# Altium schematic sheet CELL_BALANCE.SchDoc: BMS - AFE
size A4; DrawnBy: Jarod Krane; SheetNumber: 3; SheetTotal: 8
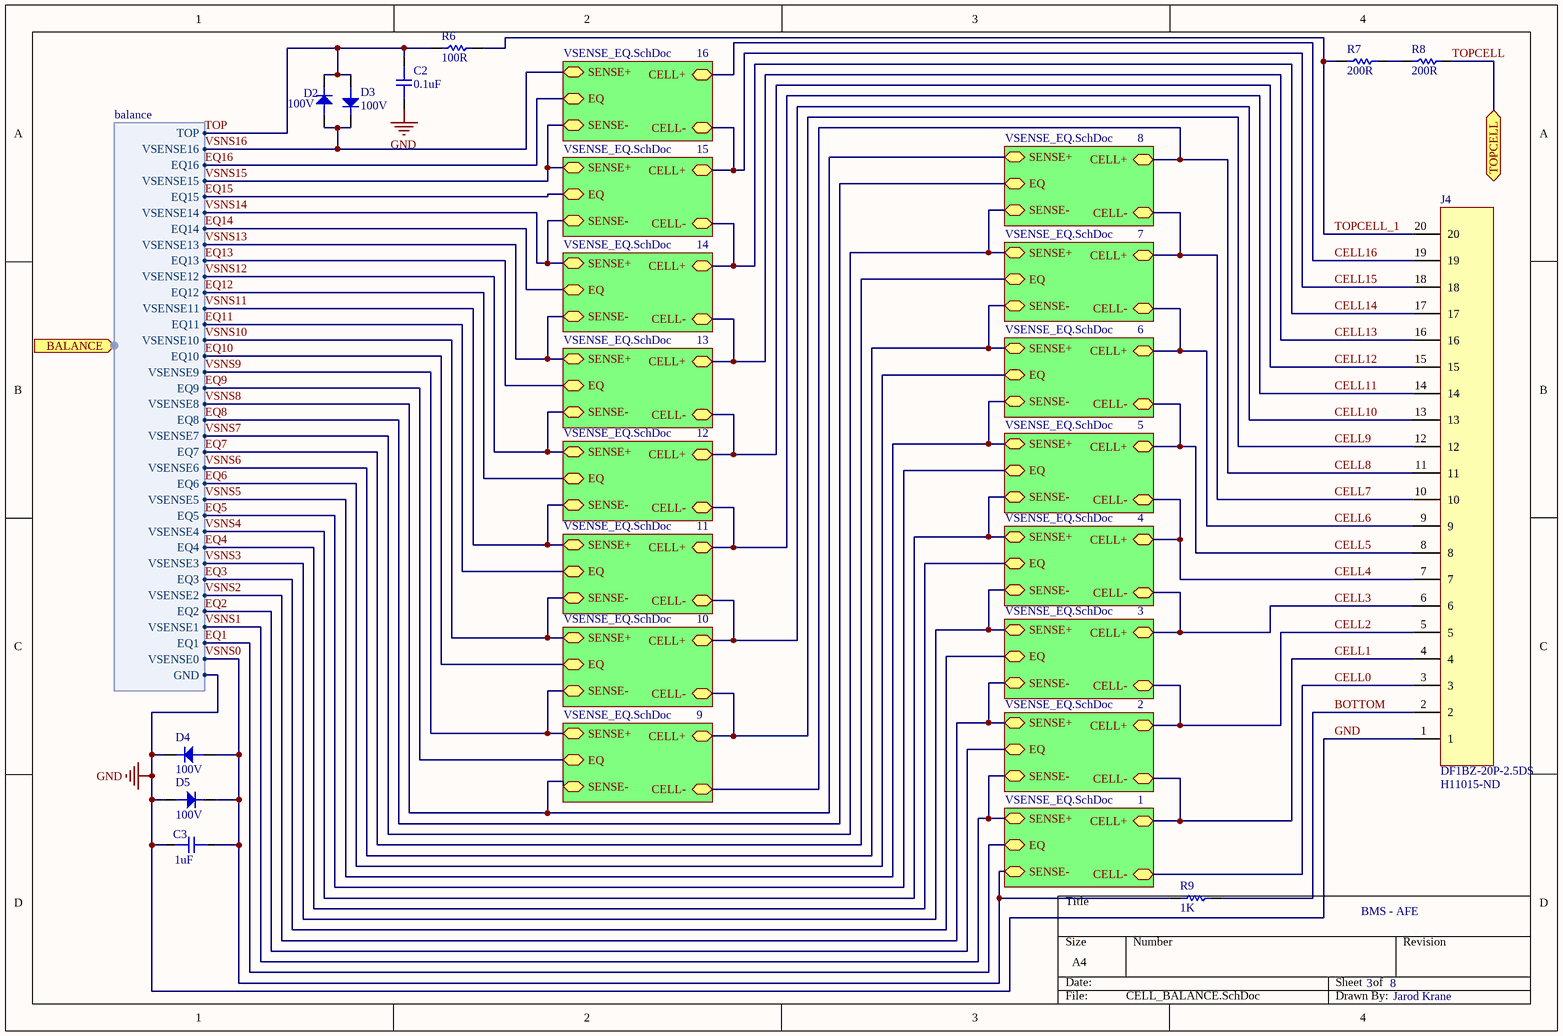
[diagram p0: CELL_BALANCE.SchDoc]

## Parts
C2  0.1uF  [1210 cap]
C3  1uF  [0603 CAP - duplicate]
D2  100V  [DIODE BtoB]
D3  100V  [DIODE BtoB]
D4  100V  [DIODE BtoB]
D5  100V  [DIODE BtoB]
J4  DF1BZ-20P-2.5DS  Supplier Part Number 1: H11015-ND  [PCBComponent_1]
R6  100R  [1206 RES]
R7  200R  [2512 RES]
R8  200R  [2512 RES]
R9  1K  [0603 RES]

## Sub-sheets
1 = VSENSE_EQ.SchDoc: SENSE+, CELL+, SENSE-, CELL-, EQ
2 = VSENSE_EQ.SchDoc: SENSE+, CELL+, SENSE-, CELL-, EQ
3 = VSENSE_EQ.SchDoc: SENSE+, CELL+, SENSE-, CELL-, EQ
4 = VSENSE_EQ.SchDoc: SENSE+, CELL+, SENSE-, CELL-, EQ
5 = VSENSE_EQ.SchDoc: SENSE+, CELL+, SENSE-, CELL-, EQ
6 = VSENSE_EQ.SchDoc: SENSE+, CELL+, SENSE-, CELL-, EQ
7 = VSENSE_EQ.SchDoc: SENSE+, CELL+, SENSE-, CELL-, EQ
8 = VSENSE_EQ.SchDoc: SENSE+, CELL+, SENSE-, CELL-, EQ
9 = VSENSE_EQ.SchDoc: SENSE+, CELL+, SENSE-, CELL-, EQ
10 = VSENSE_EQ.SchDoc: SENSE+, CELL+, SENSE-, CELL-, EQ
11 = VSENSE_EQ.SchDoc: SENSE+, CELL+, SENSE-, CELL-, EQ
12 = VSENSE_EQ.SchDoc: SENSE+, CELL+, SENSE-, CELL-, EQ
13 = VSENSE_EQ.SchDoc: SENSE+, CELL+, SENSE-, CELL-, EQ
14 = VSENSE_EQ.SchDoc: SENSE+, CELL+, SENSE-, CELL-, EQ
15 = VSENSE_EQ.SchDoc: SENSE+, CELL+, SENSE-, CELL-, EQ
16 = VSENSE_EQ.SchDoc: SENSE+, CELL+, SENSE-, CELL-, EQ

## Ports
BALANCE (harness balance), TOPCELL

## Harnesses
balance: GND, VSENSE0, EQ1, VSENSE1, EQ2, VSENSE2, EQ3, VSENSE3, EQ4, VSENSE4, EQ5, VSENSE5, EQ6, VSENSE6, EQ7, VSENSE7, EQ8, VSENSE8, EQ9, VSENSE9, EQ10, VSENSE10, EQ11, VSENSE11, EQ12, VSENSE12, EQ13, VSENSE13, EQ14, VSENSE14, EQ15, VSENSE15, EQ16, VSENSE16, TOP

## Nets
GND: C2.1 C3.1 D4.2 D5.1 J4.1 ; port BALANCE.GND
BOTTOM: J4.2 R9.2
CELL0: J4.3 ; sheet 1/CELL-
CELL1: J4.4 ; sheet 2/CELL-, sheet 1/CELL+
CELL2: J4.5 ; sheet 3/CELL-, sheet 2/CELL+
CELL3: J4.6 ; sheet 4/CELL-, sheet 3/CELL+
CELL4: J4.7 ; sheet 4/CELL+, sheet 5/CELL-
CELL5: J4.8 ; sheet 5/CELL+, sheet 6/CELL-
CELL6: J4.9 ; sheet 6/CELL+, sheet 7/CELL-
CELL7: J4.10 ; sheet 7/CELL+, sheet 8/CELL-
CELL8: J4.11 ; sheet 8/CELL+, sheet 9/CELL-
CELL9: J4.12 ; sheet 10/CELL-, sheet 9/CELL+
CELL10: J4.13 ; sheet 11/CELL-, sheet 10/CELL+
CELL11: J4.14 ; sheet 12/CELL-, sheet 11/CELL+
CELL12: J4.15 ; sheet 12/CELL+, sheet 13/CELL-
CELL13: J4.16 ; sheet 13/CELL+, sheet 14/CELL-
CELL14: J4.17 ; sheet 14/CELL+, sheet 15/CELL-
CELL15: J4.18 ; sheet 15/CELL+, sheet 16/CELL-
CELL16: J4.19 ; sheet 16/CELL+
EQ1: sheet 1/EQ, port BALANCE.EQ1
EQ2: sheet 2/EQ, port BALANCE.EQ2
EQ3: sheet 3/EQ, port BALANCE.EQ3
EQ4: sheet 4/EQ, port BALANCE.EQ4
EQ5: sheet 5/EQ, port BALANCE.EQ5
EQ6: sheet 6/EQ, port BALANCE.EQ6
EQ7: sheet 7/EQ, port BALANCE.EQ7
EQ8: sheet 8/EQ, port BALANCE.EQ8
EQ9: sheet 9/EQ, port BALANCE.EQ9
EQ10: sheet 10/EQ, port BALANCE.EQ10
EQ11: sheet 11/EQ, port BALANCE.EQ11
EQ12: sheet 12/EQ, port BALANCE.EQ12
EQ13: sheet 13/EQ, port BALANCE.EQ13
EQ14: sheet 14/EQ, port BALANCE.EQ14
EQ15: sheet 15/EQ, port BALANCE.EQ15
EQ16: sheet 16/EQ, port BALANCE.EQ16
TOP: C2.2 D2.2 D3.1 R6.1 ; port BALANCE.TOP
TOPCELL: R8.2 ; port TOPCELL
TOPCELL_1: J4.20 R6.2 R7.1
VSNS0: C3.2 D4.1 D5.2 R9.1 ; sheet 1/SENSE-, port BALANCE.VSENSE0
VSNS1: sheet 2/SENSE-, sheet 1/SENSE+, port BALANCE.VSENSE1
VSNS2: sheet 3/SENSE-, sheet 2/SENSE+, port BALANCE.VSENSE2
VSNS3: sheet 4/SENSE-, sheet 3/SENSE+, port BALANCE.VSENSE3
VSNS4: sheet 4/SENSE+, sheet 5/SENSE-, port BALANCE.VSENSE4
VSNS5: sheet 5/SENSE+, sheet 6/SENSE-, port BALANCE.VSENSE5
VSNS6: sheet 6/SENSE+, sheet 7/SENSE-, port BALANCE.VSENSE6
VSNS7: sheet 7/SENSE+, sheet 8/SENSE-, port BALANCE.VSENSE7
VSNS8: sheet 8/SENSE+, sheet 9/SENSE-, port BALANCE.VSENSE8
VSNS9: sheet 10/SENSE-, sheet 9/SENSE+, port BALANCE.VSENSE9
VSNS10: sheet 11/SENSE-, sheet 10/SENSE+, port BALANCE.VSENSE10
VSNS11: sheet 12/SENSE-, sheet 11/SENSE+, port BALANCE.VSENSE11
VSNS12: sheet 12/SENSE+, sheet 13/SENSE-, port BALANCE.VSENSE12
VSNS13: sheet 13/SENSE+, sheet 14/SENSE-, port BALANCE.VSENSE13
VSNS14: sheet 14/SENSE+, sheet 15/SENSE-, port BALANCE.VSENSE14
VSNS15: sheet 15/SENSE+, sheet 16/SENSE-, port BALANCE.VSENSE15
VSNS16: D2.1 D3.2 ; sheet 16/SENSE+, port BALANCE.VSENSE16
NetR7_2: R7.2 R8.1

## Library data of the parts
C2 = C1210C104KARACTU: CAP CER 0.1UF 250V X7R 1210; Manufacturer: KEMET; Dielectric Material: Ceramic; Capacitance: 100nF; Tolerance: 10%; Dissipation Factor: 2.5%; Supplier 1: Digi-Key; Manufacturer Part Number: C1210C104KARACTU; Stock 1: 3355; Pricing 1: 1=0.68, 10=0.479, 100=0.3156, 500=0.2338, 1000=0.1987 (USD); Mount: PCB,Surface Mount; Case/Package: 1210; Number of Pins: 2; Case Code (Imperial): 1210; Case Code (Metric): 3225; Min Operating Temperature: -55°C; Max Operating Temperature: 125°C; Voltage Rating (DC): 250V; Voltage Rating: 250V; Packaging: Tape and Reel; Package Quantity: 1; Dielectric: X7R; Termination: SMD/SMT; Voltage: 250V; Length: 3.2mm; Height: 1.5mm; Width: 2.5mm; Thickness: 0.055inch; Depth: 2.5mm; REACH SVHC: No SVHC; Supplier Part Number 1: 399-4676-1-ND
C3 = C1608X7R1C105K080AC: CAP CER 1UF 16V X7R 0603; Manufacturer: TDK; Dielectric Material: Ceramic; Tolerance: 10%; Supplier 1: Digi-Key; Manufacturer Part Number: C1608X7R1C105K080AC; Stock 1: 0; Pricing 1: 1=0.12, 10=0.087, 100=0.0387, 500=0.0277, 1000=0.0217 (USD); Mount: Surface Mount; Case/Package: 0603; Weight: 7.1E-05oz; Case Code (Metric): 1608; Case Code (Imperial): 0603; Min Operating Temperature: -55°C; Max Operating Temperature: 125°C; Packaging: Tape and Reel; Package Quantity: 1; Capacitance: 1uF; Voltage Rating: 16V; Voltage Rating (DC): 16V; Dielectric: X7R; Termination: SMD/SMT; Composition: Ceramic; Voltage: 16V; Length: 1.6mm; Height: 0.8mm; Width: 0.031inch; Thickness: 0.037inch; Depth: 0.8mm; Radiation Hardening: No; REACH SVHC: No SVHC; Lead Free: Lead Free; Supplier Part Number 1: 445-1604-1-ND
D2-D5 = 1N4148W-7-F: DIODE GEN PURP 100V 300MA SOD123; Manufacturer: Diodes; Max Surge Current: 2A; Forward Current: 150mA; Peak Reverse Current: 1uA; Recovery Time: 4ns; Forward Voltage: 1.25V; Power Dissipation: 400mW; Element Configuration: Single; Polarity: Standard; Voltage Rating (DC): 75V; Capacitance: 2pF; Current: 15A; Supplier 1: Digi-Key; Manufacturer Part Number: 1N4148W-7-F; Stock 1: 0; Pricing 1: 1=0.18, 10=0.164, 100=0.0891, 500=0.0548, 1000=0.0374 (USD); Mount: Surface Mount; Number of Pins: 2; Weight: 0.000353oz; Contact Plating: Matte,Tin; Min Operating Temperature: -65°C; Max Operating Temperature: 150°C; Package Quantity: 3000; Packaging: Tape and Reel; Average Rectified Current: 300mA; Reverse Recovery Time: 4ns; Max Repetitive Reverse Voltage (Vrrm): 100V; Peak Non-Repetitive Surge Current: 2A; Power Rating: 400mW; Max Reverse Voltage (DC): 100V; Max Forward Surge Current (Ifsm): 2A; Current Rating: 150mA; Output Current: 150mA; Voltage: 100V; Length: 2.85mm; Height: 1.25mm; Width: 1.7mm; Radiation Hardening: No; Lead Free: Lead Free; REACH SVHC: No SVHC; Supplier Part Number 1: 1N4148W-FDICT-ND
J4 = DF1BZ-20P-2.5DS: CONN HEADER 20POS 2.5MM R/A TIN; Manufacturer: Hirose; Number of Positions: 20; Gender: Male; Connector Type: Male Pin; Pitch: 0.098inch; Supplier 1: Digi-Key; Manufacturer Part Number: DF1BZ-20P-2.5DS; Stock 1: 76; Pricing 1: 1=0.87, 10=0.765, 100=0.66, 500=0.54, 1000=0.48 (USD); Mount: Through Hole; Contact Plating: Tin; Colour: White; Housing Colour: White; Package Quantity: 100; Packaging: Bulk; Number of Rows: 1; Termination: Solder; Number of Contacts: 20; Contact Mating Length: 0.177inch; Lead Free: Lead Free
R6 = ERJ-8ENF1000V: RES SMD 100 OHM 1% 1/4W 1206; Manufacturer: Panasonic; Power Rating: 250mW; Voltage Rating: 200V; Temperature Coefficient: 100ppm/°C; Supplier 1: Digi-Key; Manufacturer Part Number: ERJ-8ENF1000V; Stock 1: 474856; Pricing 1: 1=0.11, 10=0.1, 100=0.0385, 1000=0.017, 2500=0.0146 (USD); Mount: Surface Mount; Case/Package: 1206; Number of Pins: 2; Case Code (Metric): 3216; Case Code (Imperial): 1206; Contact Plating: Tin; Min Operating Temperature: -55°C; Max Operating Temperature: 155°C; Resistance: 100R; Tolerance: 1%; Packaging: Tape and Reel; Package Quantity: 1; Composition: Thick Film; Number of Terminations: 2; Termination: SMD/SMT; Military Standard: Not; Max Power Dissipation: 250mW; Voltage Rating (DC): 200V; Features: Automotive AEC-Q200; Working Voltage: 200V; Length: 3.2mm; Height: 0.6mm; Width: 0.063inch; Depth: 1.6mm; Radiation Hardening: No; REACH SVHC: No SVHC; Lead Free: Lead Free; Supplier Part Number 1: P100FCT-ND
R7 R8 = CRCW2512200RJNEG: RES SMD 200 OHM 5% 1W 2512; Manufacturer: Vishay Dale; Voltage Rating: 500V; Temperature Coefficient: 200ppm/°C; Supplier 1: Digi-Key; Manufacturer Part Number: CRCW2512200RJNEG; Stock 1: 0; Pricing 1: 1=0.39, 10=0.333, 100=0.1301, 1000=0.0545 (USD); Mount: Surface Mount; Case/Package: 2512; Number of Pins: 2; Weight: 0.001429oz; Case Code (Metric): 6432; Case Code (Imperial): 2512; Contact Plating: Tin; Min Operating Temperature: -55°C; Max Operating Temperature: 155°C; Resistance: 200R; Tolerance: 5%; Packaging: Tape and Reel; Power Rating: 1W; Package Quantity: 2000; Composition: Thick Film; Number of Terminations: 2; Termination: SMD/SMT; Military Standard: Not; Max Power Dissipation: 1W; Voltage Rating (DC): 500V; Working Voltage: 500V; Features: Automotive AEC-Q200; Length: 6.3mm; Height: 0.6mm; Width: 0.124inch; Depth: 3.15mm; Radiation Hardening: No; REACH SVHC: Unknown; Lead Free: Lead Free; Supplier Part Number 1: 541-200XCT-ND
R9 = CRCW06031K00FKEA: RES SMD 1K OHM 1% 1/10W 0603; Manufacturer: Vishay Dale; Resistance: 1kR; Power Rating: 100mW; Voltage Rating: 75V; Temperature Coefficient: 100ppm/°C; Supplier 1: Digi-Key; Manufacturer Part Number: CRCW06031K00FKEA; Stock 1: 3823619; Pricing 1: 1=0.1, 10=0.042, 100=0.017, 1000=0.0076, 2500=0.0066 (USD); Mount: Surface Mount; Case/Package: 0603; Number of Pins: 2; Weight: 7.1E-05oz; Case Code (Metric): 1608; Case Code (Imperial): 0603; Contact Plating: Tin; Min Operating Temperature: -55°C; Max Operating Temperature: 155°C; Composition: Thick Film; Tolerance: 1%; Packaging: Tape and Reel; Package Quantity: 10; Number of Terminations: 2; Termination: SMD/SMT; Military Standard: Not; Max Power Dissipation: 100mW; Voltage Rating (DC): 75V; Features: Automotive AEC-Q200; Length: 1.55mm; Height: 0.45mm; Width: 0.033inch; Depth: 0.85mm; Radiation Hardening: No; REACH SVHC: Unknown; Lead Free: Lead Free; Supplier Part Number 1: 541-1.00KHCT-ND